# Altium schematic sheet PAGE1.SchDoc
size 297 x 209 mm
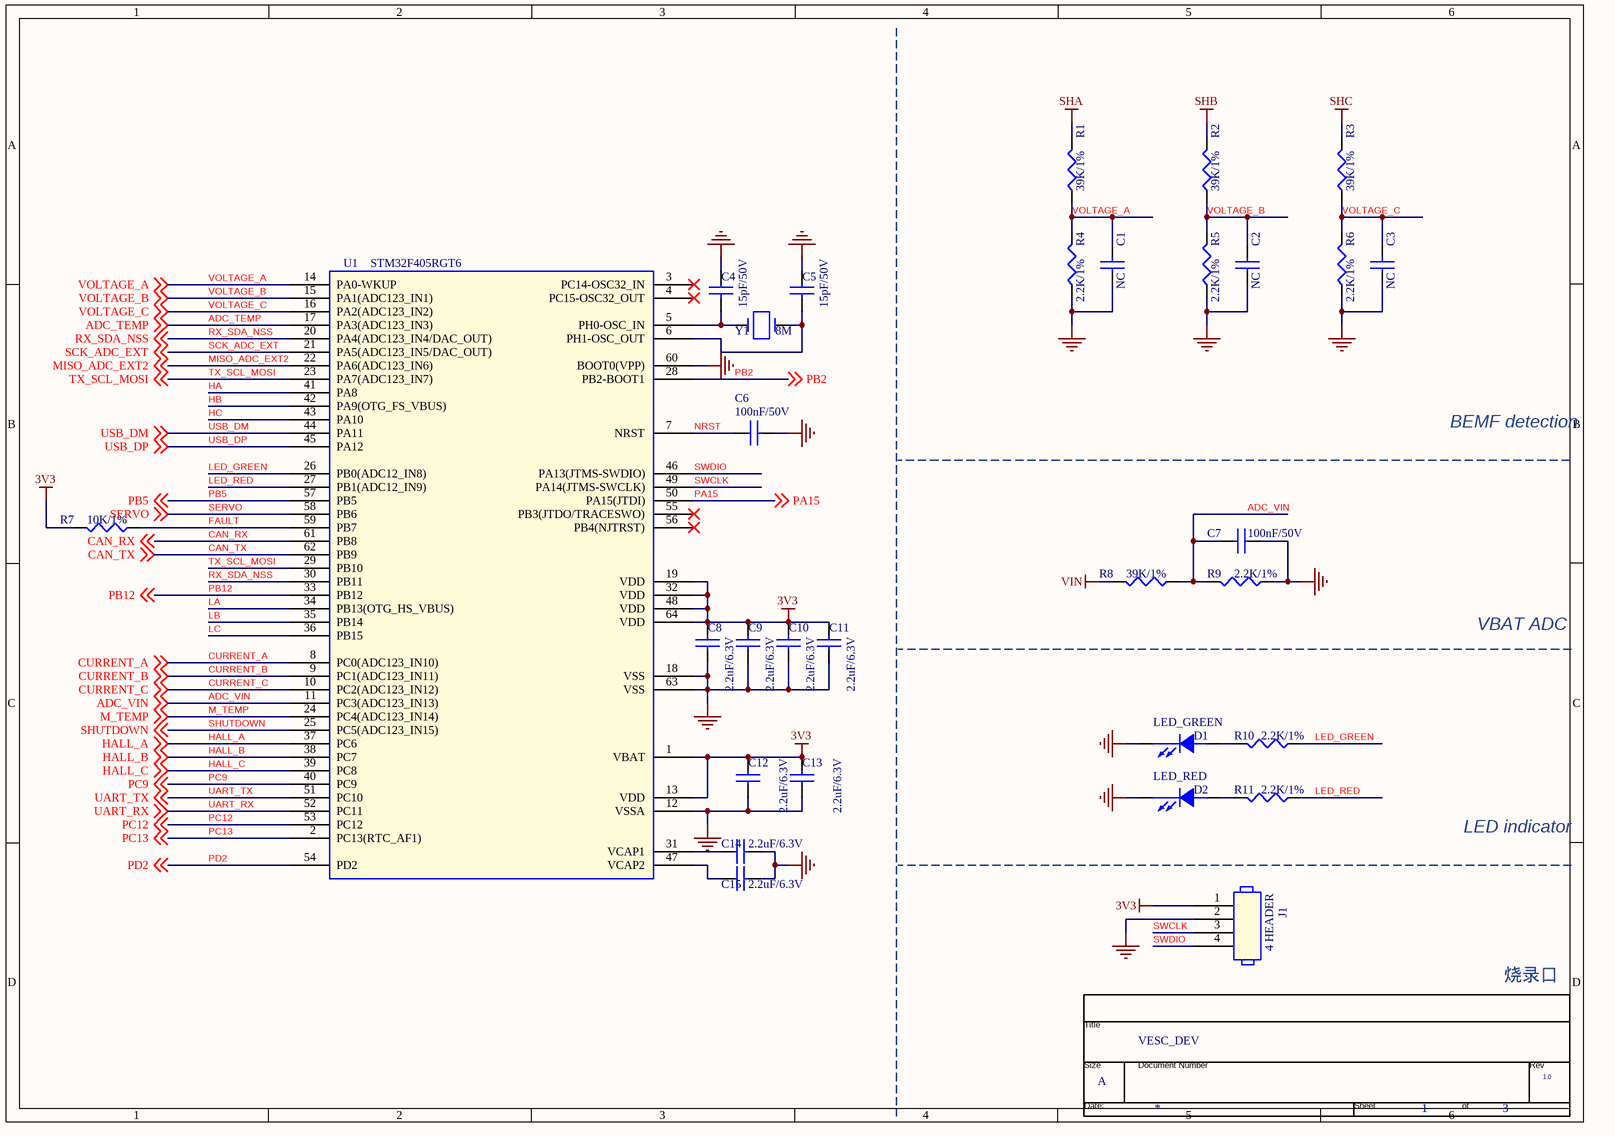
[diagram p0: PAGE1.SchDoc]

## Parts
*  Page Count: 3  Page Number: 1  Page Size: A  Title: VESC_DEV  RevCode: 1.0  (hidden comment: TitleBlock0)  (graphical)
C1  NC  [C0402]
C2  NC  [C0402]
C3  NC  [C0402]
C4  15pF/50V  [C0402]
C5  15pF/50V  [C0402]
C6  100nF/50V  [C0402]
C7  100nF/50V  [C0402]
C8  2.2uF/6.3V  [C0402]
C9  2.2uF/6.3V  [C0402]
C10  2.2uF/6.3V  [C0402]
C11  2.2uF/6.3V  [C0402]
C12  2.2uF/6.3V  [C0402]
C13  2.2uF/6.3V  [C0402]
C14  2.2uF/6.3V  [C0402]
C15  2.2uF/6.3V  [C0402]
D1  LED_GREEN  [LED0603]
D2  LED_RED  [LED0603]
J1  4 HEADER  [ISP-4P-2_54]
R1  39K/1%  [R0402]
R2  39K/1%  [R0402]
R3  39K/1%  [R0402]
R4  2.2K/1%  [R0402]
R5  2.2K/1%  [R0402]
R6  2.2K/1%  [R0402]
R7  10K/1%  [R0402]
R8  39K/1%  [R0402]
R9  2.2K/1%  [R0402]
R10  2.2K/1%  [R0402]
R11  2.2K/1%  [R0402]
U1  STM32F405RGT6  [LQFP64_10X10_05P]
Y1  8M  [SMD5032-2P]

## Nets
3V3: C8.2 C9.2 C10.2 C11.2 C12.2 C13.2 J1.1 R7.2 U1.1(VBAT) U1.13(VDD) U1.19(VDD) U1.32(VDD) U1.48(VDD) U1.64(VDD)
GND: C1.1 C2.1 C3.1 C4.1 C5.1 C6.2 C7.1 C8.1 C9.1 C10.1 C11.1 C12.1 C13.1 C14.2 C15.2 D1.1(CATHODE) D2.1(CATHODE) J1.2 R4.1 R5.1 R6.1 R9.1 U1.12(VSSA) U1.18(VSS) U1.60(BOOT0(VPP)) U1.63(VSS)
SHA: R1.2
SHB: R2.2
SHC: R3.2
VIN: R8.2
ADC_TEMP: U1.17(PA3(ADC123_IN3)) ; off-sheet ADC_TEMP
ADC_VIN: C7.2 R8.1 R9.2 U1.11(PC3(ADC123_IN13)) ; off-sheet ADC_VIN
CAN_RX: U1.61(PB8) ; off-sheet CAN_RX
CAN_TX: U1.62(PB9) ; off-sheet CAN_TX
CURRENT_A: U1.8(PC0(ADC123_IN10)) ; off-sheet CURRENT_A
CURRENT_B: U1.9(PC1(ADC123_IN11)) ; off-sheet CURRENT_B
CURRENT_C: U1.10(PC2(ADC123_IN12)) ; off-sheet CURRENT_C
FAULT: R7.1 U1.59(PB7)
HA: U1.41(PA8)
HALL_A: U1.37(PC6) ; off-sheet HALL_A
HALL_B: U1.38(PC7) ; off-sheet HALL_B
HALL_C: U1.39(PC8) ; off-sheet HALL_C
HB: U1.42(PA9(OTG_FS_VBUS))
HC: U1.43(PA10)
LA: U1.34(PB13(OTG_HS_VBUS))
LB: U1.35(PB14)
LC: U1.36(PB15)
LED_GREEN: R10.1 U1.26(PB0(ADC12_IN8))
LED_RED: R11.1 U1.27(PB1(ADC12_IN9))
M_TEMP: U1.24(PC4(ADC123_IN14)) ; off-sheet M_TEMP
MISO_ADC_EXT2: U1.22(PA6(ADC123_IN6)) ; off-sheet MISO_ADC_EXT2
NRST: C6.1 U1.7(NRST)
PA15: U1.50(PA15(JTDI)) ; off-sheet PA15
PB2: U1.28(PB2-BOOT1) ; off-sheet PB2
PB5: U1.57(PB5) ; off-sheet PB5
PB12: U1.33(PB12) ; off-sheet PB12
PC9: U1.40(PC9) ; off-sheet PC9
PC12: U1.53(PC12) ; off-sheet PC12
PC13: U1.2(PC13(RTC_AF1)) ; off-sheet PC13
PD2: U1.54(PD2) ; off-sheet PD2
RX_SDA_NSS: U1.20(PA4(ADC123_IN4/DAC_OUT)) U1.30(PB11) ; off-sheet RX_SDA_NSS
SCK_ADC_EXT: U1.21(PA5(ADC123_IN5/DAC_OUT)) ; off-sheet SCK_ADC_EXT
SERVO: U1.58(PB6) ; off-sheet SERVO
SHUTDOWN: U1.25(PC5(ADC123_IN15)) ; off-sheet SHUTDOWN
SWCLK: J1.3 U1.49(PA14(JTMS-SWCLK))
SWDIO: J1.4 U1.46(PA13(JTMS-SWDIO))
TX_SCL_MOSI: U1.23(PA7(ADC123_IN7)) U1.29(PB10) ; off-sheet TX_SCL_MOSI
UART_RX: U1.52(PC11) ; off-sheet UART_RX
UART_TX: U1.51(PC10) ; off-sheet UART_TX
USB_DM: U1.44(PA11) ; off-sheet USB_DM
USB_DP: U1.45(PA12) ; off-sheet USB_DP
VOLTAGE_A: C1.2 R1.1 R4.2 U1.14(PA0-WKUP) ; off-sheet VOLTAGE_A
VOLTAGE_B: C2.2 R2.1 R5.2 U1.15(PA1(ADC123_IN1)) ; off-sheet VOLTAGE_B
VOLTAGE_C: C3.2 R3.1 R6.2 U1.16(PA2(ADC123_IN2)) ; off-sheet VOLTAGE_C
NetC4_2: C4.2 U1.5(PH0-OSC_IN) Y1.2
NetC5_2: C5.2 U1.6(PH1-OSC_OUT) Y1.1
NetC14_1: C14.1 U1.31(VCAP1)
NetC15_1: C15.1 U1.47(VCAP2)
NetD1_2: D1.2(ANODE) R10.2
NetD2_2: D2.2(ANODE) R11.2

Not connected (* = marked no-connect by the designer): U1 3(PC14-OSC32_IN)* 4(PC15-OSC32_OUT)* 55(PB3(JTDO/TRACESWO))* 56(PB4(NJTRST))*

## Notes on the sheet
- BEMF detection
- VBAT ADC
- LED indicator
- 烧录口
- (in symbol TitleBlock0) Title; Size; Document Number; Rev; Date:; Sheet; of

## Library data of the parts
C1-C15 = CAP NP: PCB Footprint: C0402
D1 D2 = LED: PCB Footprint: LED0603
R1-R11 = RESISTOR: PCB Footprint: R0402
Y1 = CRYSTAL: PCB Footprint: SMD5032-2P
* = TitleBlock0: Page Create Date: March  8, 1995; Page Modify Date: *
J1 = 4 HEADER: PCB Footprint: ISP-4P-2_54
U1 = STM32F405RGT6: PCB Footprint: LQFP64_10X10_05P